# Altium schematic sheet 03 PMIC1.SchDoc
size 420 x 297 mm
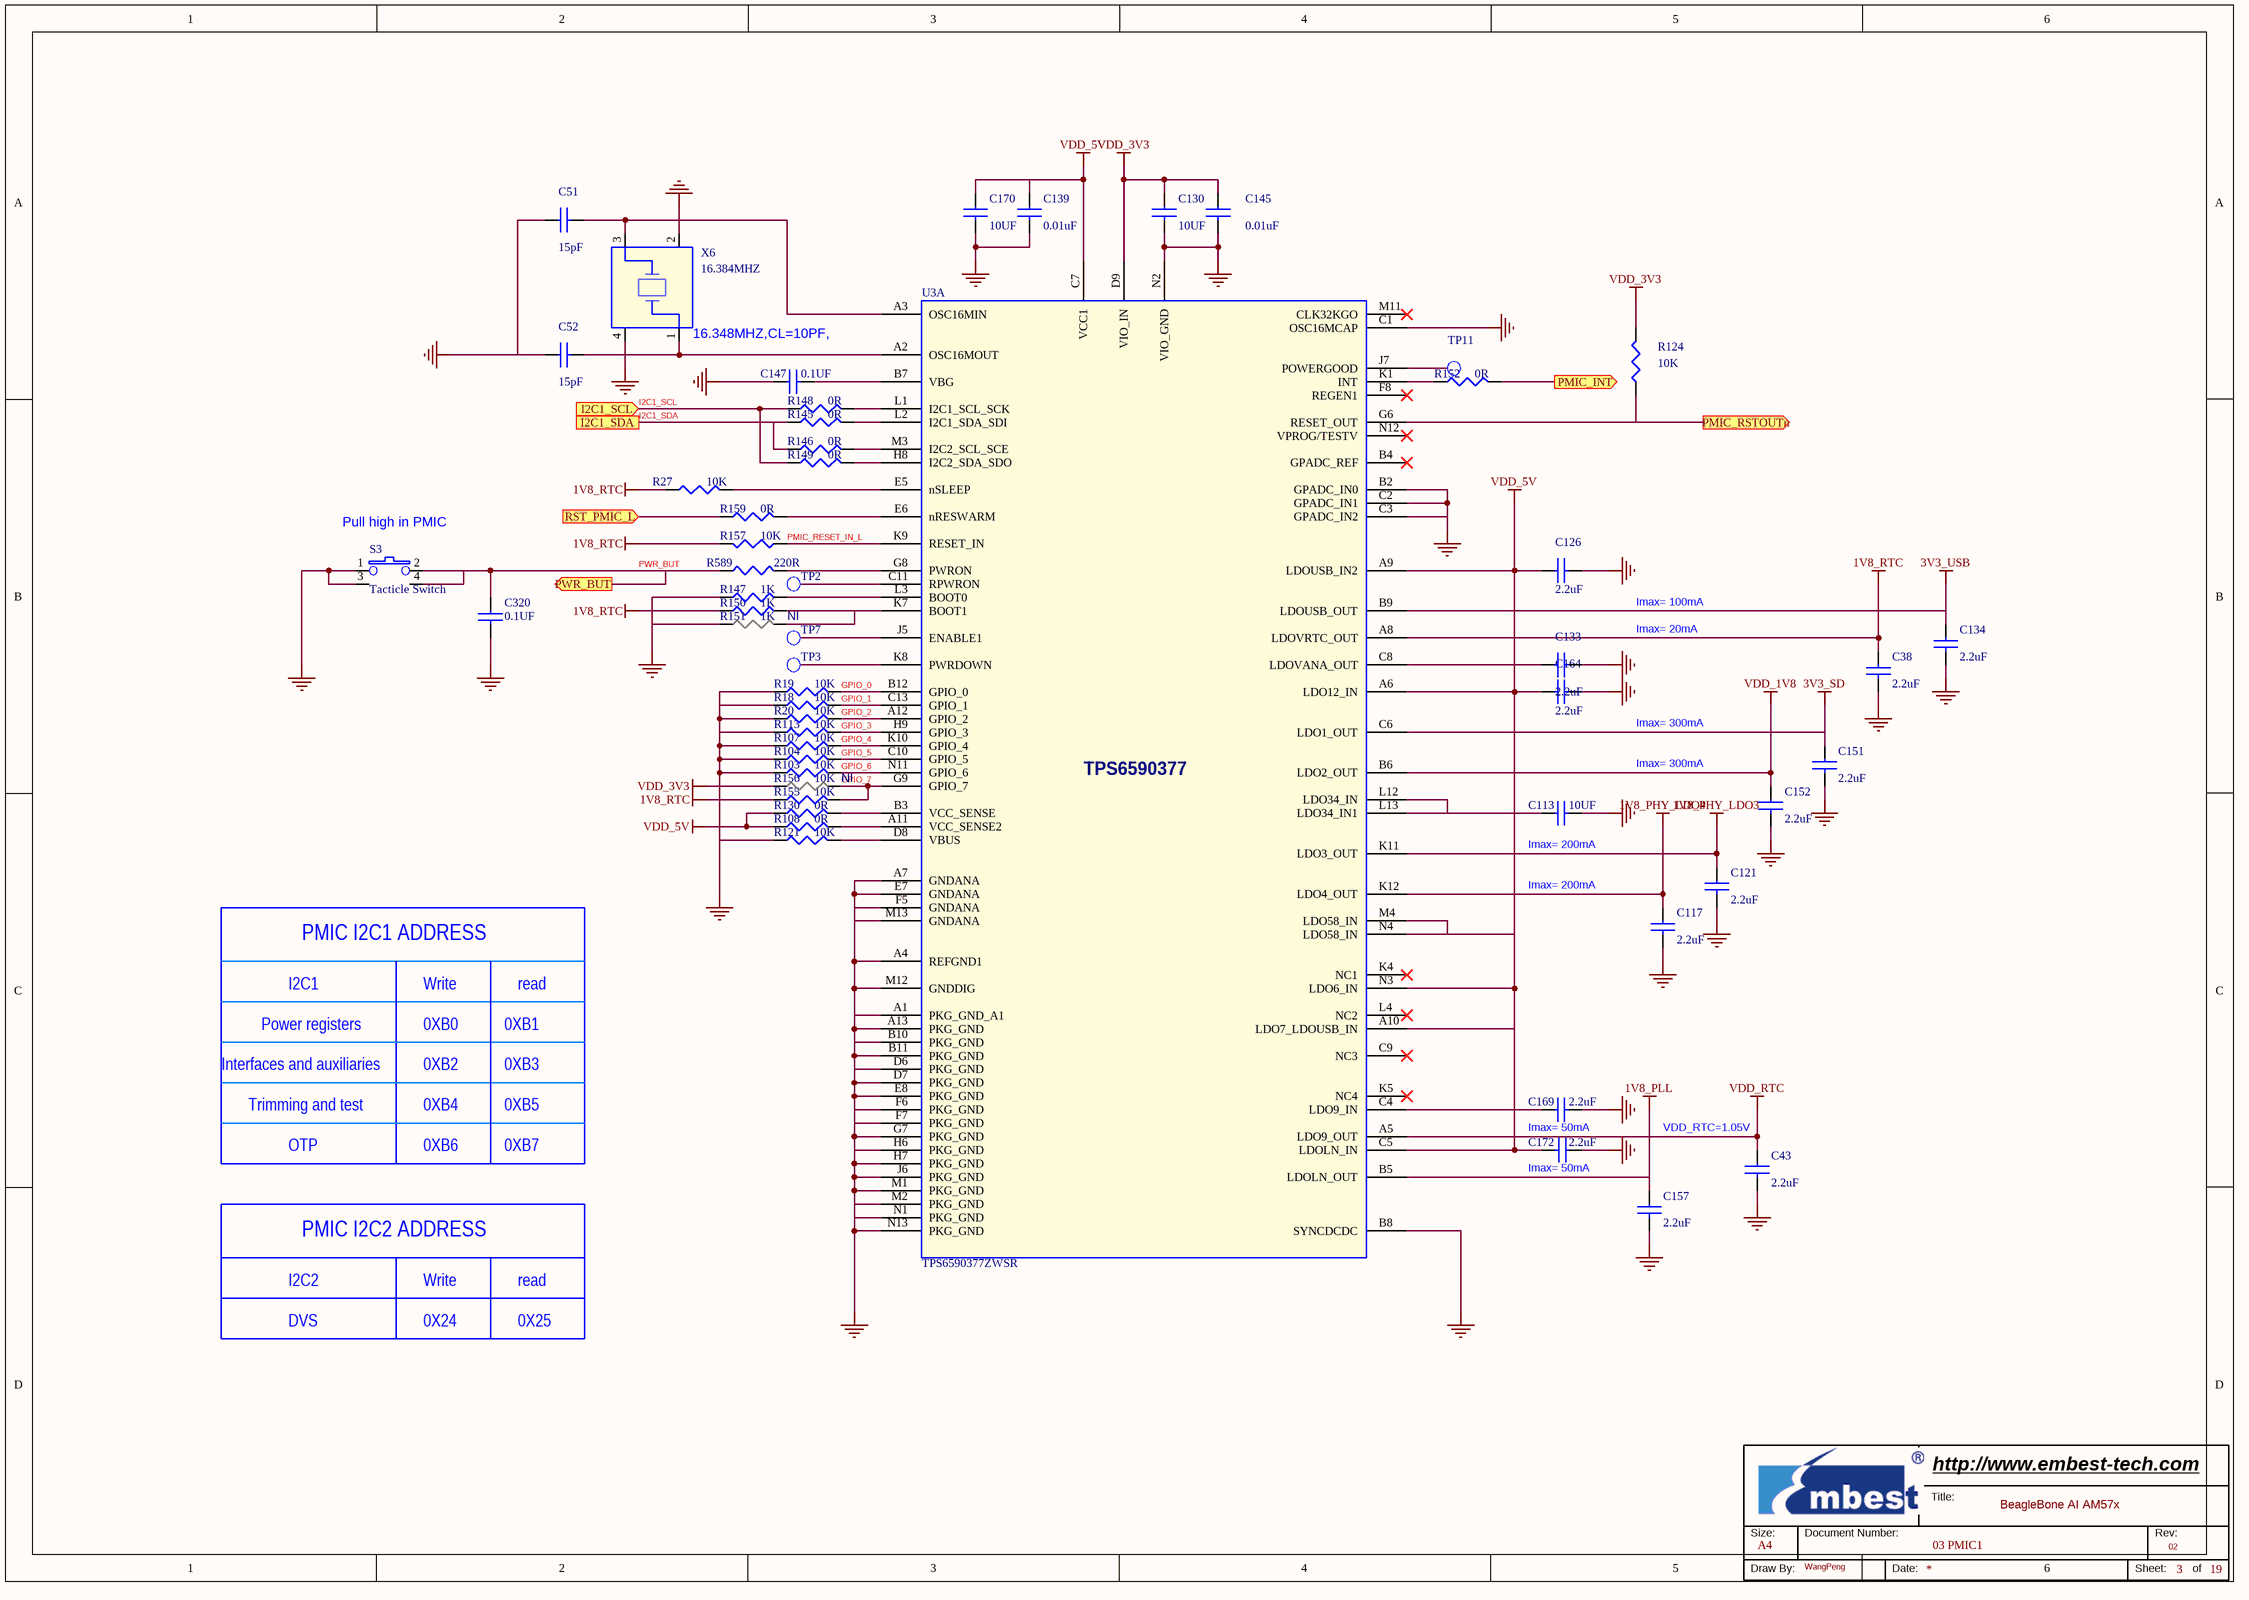
[diagram p0: 03 PMIC1.SchDoc]

## Parts
*  Page Count: 19  Page Number: 3  Page Size: A4  Title: BeagleBone AI AM57x  RevCode: 02  Doc: 03 PMIC1  Drawing: WangPeng  (hidden comment: Embest Title)  (graphical)
C38  2.2uF  [C0402]
C43  2.2uF  [C0402]
C51  15pF  [C0402]
C52  15pF  [C0402]
C113  10UF  [C0603]
C117  2.2uF  [C0402]
C121  2.2uF  [C0402]
C126  2.2uF  [C0603]
C130  10UF  [C0603]
C133  2.2uF  [C0402]
C134  2.2uF  [C0402]
C139  0.01uF  [C0402]
C145  0.01uF  [C0402]
C147  0.1UF  [C0402]
C151  2.2uF  [C0402]
C152  2.2uF  [C0402]
C157  2.2uF  [C0402]
C164  2.2uF  [C0603]
C169  2.2uF  [C0603]
C170  10UF  [C0603]
C172  2.2uF  [C0603]
C320  0.1UF  [C0402]
R18  10K  [R0402]
R19  10K  [R0402]
R20  10K  [R0402]
R27  10K  [R0402]
R103  10K  [R0402]
R104  10K  [R0402]
R107  10K  [R0402]
R108  0R  [R0402]
R113  10K  [R0402]
R121  10K  [R0402]
R124  10K  [R0402]
R130  0R  [R0402]
R145  0R  [R0402]
R146  0R  [R0402]
R147  1K  [R0402]
R148  0R  [R0402]
R149  0R  [R0402]
R150  1K  [R0402]
R151  1K  ASSY: NI  [R0402]
R152  0R  [R0402]
R155  10K  [R0402]
R156  10K  ASSY: NI  [R0402]
R157  10K  [R0402]
R159  0R  [R0402]
R589  220R  [R0402]
S3  Tacticle Switch  [SWS4B46X28]
TP2  NI  [TP1-8040]  (value not drawn)
TP3  NI  [TP1-8040]  (value not drawn)
TP7  NI  [TP1-8040]  (value not drawn)
TP11  NI  [TP1-8040]  (value not drawn)
U3  TPS6590377ZWSR  [bga12x12-169-55m]  (part A of 2)
X6  16.384MHZ  [OSCCC250x200x60-4N]

## Ports
I2C1_SCL (in), I2C1_SDA, PMIC_INT (out), PMIC_RSTOUTn (out), PWR_BUT (out), RST_PMIC_L (in)

## Nets
1V8_PHY_LDO3: C121.1 U3.K11(LDO3_OUT)
1V8_PHY_LDO4: C117.1 U3.K12(LDO4_OUT)
1V8_PLL: C157.1 U3.B5(LDOLN_OUT)
1V8_RTC: C38.1 R27.1 R150.1 R155.1 R157.2 U3.A8(LDOVRTC_OUT)
3V3_SD: C151.1 U3.C6(LDO1_OUT)
3V3_USB: C134.1 U3.B9(LDOUSB_OUT)
GND: C38.2 C43.2 C51.1 C52.1 C113.2 C117.2 C121.2 C126.2 C130.2 C133.2 C134.2 C139.2 C145.2 C147.1 C151.2 C152.2 C157.2 C164.2 C169.2 C170.2 C172.1 C320.2 R18.1 R19.1 R20.1 R103.1 R104.1 R107.1 R113.1 R121.1 R147.1 R151.1 S3.1 S3.3 U3.A1(PKG_GND_A1) U3.A4(REFGND1) U3.A7(GNDANA) U3.A13(PKG_GND) U3.B2(GPADC_IN0) U3.B8(SYNCDCDC) U3.B10(PKG_GND) U3.B11(PKG_GND) U3.C1(OSC16MCAP) U3.C2(GPADC_IN1) U3.C3(GPADC_IN2) U3.D6(PKG_GND) U3.D7(PKG_GND) U3.E7(GNDANA) U3.E8(PKG_GND) U3.F5(GNDANA) U3.F6(PKG_GND) U3.F7(PKG_GND) U3.G7(PKG_GND) U3.H6(PKG_GND) U3.H7(PKG_GND) U3.J6(PKG_GND) U3.M1(PKG_GND) U3.M2(PKG_GND) U3.M12(GNDDIG) U3.M13(GNDANA) U3.N1(PKG_GND) U3.N2(VIO_GND) U3.N13(PKG_GND) X6.2 X6.4
VDD_1V8: C152.1 U3.B6(LDO2_OUT)
VDD_3V3: C130.1 C145.1 R124.2 R156.1 U3.D9(VIO_IN)
VDD_5V: C126.1 C139.1 C164.1 C170.1 C172.2 R108.1 R130.1 U3.A6(LDO12_IN) U3.A9(LDOUSB_IN2) U3.A10(LDO7_LDOUSB_IN) U3.C5(LDOLN_IN) U3.C7(VCC1) U3.M4(LDO58_IN) U3.N3(LDO6_IN) U3.N4(LDO58_IN)
VDD_RTC: C43.1 U3.A5(LDO9_OUT)
GPIO_0: R19.2 U3.B12(GPIO_0)
GPIO_1: R18.2 U3.C13(GPIO_1)
GPIO_2: R20.2 U3.A12(GPIO_2)
GPIO_3: R113.2 U3.H9(GPIO_3)
GPIO_4: R107.2 U3.K10(GPIO_4)
GPIO_5: R104.2 U3.C10(GPIO_5)
GPIO_6: R103.2 U3.N11(GPIO_6)
GPIO_7: R155.2 R156.2 U3.G9(GPIO_7)
I2C1_SCL: R148.1 R149.1 ; port I2C1_SCL
I2C1_SDA: R145.1 R146.1 ; port I2C1_SDA
PMIC_INT: R152.2 ; port PMIC_INT
PMIC_RESET_IN_L: R157.1 U3.K9(RESET_IN)
PMIC_RSTOUTn: R124.1 U3.G6(RESET_OUT) ; port PMIC_RSTOUTn
PWR_BUT: C320.1 R589.1 S3.2 S3.4 ; port PWR_BUT
RST_PMIC_L: R159.1 ; port RST_PMIC_L
NetC51_2: C51.2 U3.A3(OSC16MIN) X6.3
NetC52_2: C52.2 U3.A2(OSC16MOUT) X6.1
NetC113_1: C113.1 U3.L12(LDO34_IN) U3.L13(LDO34_IN1)
NetC133_1: C133.1 U3.C8(LDOVANA_OUT)
NetC147_2: C147.2 U3.B7(VBG)
NetC169_1: C169.1 U3.C4(LDO9_IN)
NetR27_2: R27.2 U3.E5(nSLEEP)
NetR108_2: R108.2 U3.A11(VCC_SENSE2)
NetR121_2: R121.2 U3.D8(VBUS)
NetR130_2: R130.2 U3.B3(VCC_SENSE)
NetR145_2: R145.2 U3.L2(I2C1_SDA_SDI)
NetR146_2: R146.2 U3.M3(I2C2_SCL_SCE)
NetR147_2: R147.2 U3.L3(BOOT0)
NetR148_2: R148.2 U3.L1(I2C1_SCL_SCK)
NetR149_2: R149.2 U3.H8(I2C2_SDA_SDO)
NetR150_2: R150.2 R151.2 U3.K7(BOOT1)
NetR152_1: R152.1 U3.K1(INT)
NetR159_2: R159.2 U3.E6(nRESWARM)
NetR589_2: R589.2 U3.G8(PWRON)
NetTP2_1: TP2.1(TP) U3.C11(RPWRON)
NetTP3_1: TP3.1(TP) U3.K8(PWRDOWN)
NetTP7_1: TP7.1(TP) U3.J5(ENABLE1)
NetTP11_1: TP11.1(TP) U3.J7(POWERGOOD)

Not connected (* = marked no-connect by the designer): U3 B4(GPADC_REF)* C9(NC3)* F8(REGEN1)* K4(NC1)* K5(NC4)* L4(NC2)* M11(CLK32KGO)* N12(VPROG/TESTV)*

## Notes on the sheet
- (near X6) 16.348MHZ,CL=10PF,
- (near S3) Pull high in PMIC
- Imax= 100mA
- Imax= 20mA
- Imax= 300mA
- (near C113) Imax= 200mA
- Imax= 200mA
- I2C1
- PMIC I2C1 ADDRESS
- Write
- read
- Interfaces and auxiliaries
- Power registers
- 0XB0
- 0XB2
- 0XB1
- 0XB3
- Trimming and test
- 0XB4
- 0XB5
- Imax= 50mA
- (near C43) VDD_RTC=1.05V
- OTP
- 0XB6
- 0XB7
- (near C172) Imax= 50mA
- PMIC I2C2 ADDRESS
- I2C2
- DVS
- 0X24
- 0X25
- (in symbol Embest Title) Title:; Size:; Document Number:; Rev:; Draw By:; Date:; Sheet:; of
- (in symbol TPS659037, part A) TPS6590377

## Library data of the parts
C38 C117 C121 C134 C151 = C: CAP,2.2UF,+/-20%,X5R,6.3V,SMD0402; Manufacturer: Murata; Manufacturer Part Number: GRM155R60J225ME15D; Embest PN: 1004001100059; Part Type: Ceramic Capacitor
C43 C133 C152 C157 = C: CAP,2.2UF,+/-20%,X5R,6.3V,SMD0402; Manufacturer Part Number: GRM155R60J225ME15D; Manufacturer: Murata; Embest PN: 1004001100059; Part Type: Ceramic Capacitor
C51 = C: CAP,15pF,+/-2%,C0G,50V,SMD0402; Manufacturer: Murata; Manufacturer Part Number: GRM1555C1H150GA01D; Embest PN: 1004001100319; Part Type: Ceramic Capacitor; Datasheet: Y:\ÐÂK3ÏµÍ³ÎïÁÏdatasheet\[1003_1004]capacitor-resistor µçÈÝ¡¢µç×è\1004001100319 GRM1555C1H150GA01DMurata.pdf
C52 = C: CAP,15pF,+/-2%,C0G,50V,SMD0402; Manufacturer Part Number: GRM1555C1H150GA01D; Manufacturer: Murata; Embest PN: 1004001100319; Datasheet: Y:\ÐÂK3ÏµÍ³ÎïÁÏdatasheet\[1003_1004]capacitor-resistor µçÈÝ¡¢µç×è\1004001100319 GRM1555C1H150GA01DMurata.pdf; Part Type: Ceramic Capacitor
C113 = C: CAP,10UF,+/-10%,X5R,10V,SMD0603; Manufacturer: Murata; Manufacturer Part Number: GRM188R61A106KE69D; Embest PN: 1004001100129; Part Type: Ceramic Capacitor; Datasheet: Y:\ÐÂK3ÏµÍ³ÎïÁÏdatasheet\[1003_1004]capacitor-resistor µçÈÝ¡¢µç×è\1004001100129T2 C1608X5R1A106M.pdf
C126 C164 = C: CAP,2.2UF,+/-10%,X5R,16V,SMD0603; Manufacturer Part Number: GRM188R61C225KE15D; Manufacturer: Murata; Embest PN: 1004001100124; Part Type: Ceramic Capacitor
C130 C170 = C: CAP,10UF,+/-10%,X5R,10V,SMD0603; Manufacturer Part Number: GRM188R61A106KE69D; Manufacturer: Murata; Embest PN: 1004001100129; Datasheet: Y:\ÐÂK3ÏµÍ³ÎïÁÏdatasheet\[1003_1004]capacitor-resistor µçÈÝ¡¢µç×è\1004001100129T2 C1608X5R1A106M.pdf; Part Type: Ceramic Capacitor
C139 C145 = C: CAP,10NF,+/-10%,X7R,16V,SMD0402; Manufacturer Part Number: GRM155R71C103KA01D; Manufacturer: MURATA; Embest PN: 1004001100039; Part Type: Ceramic Capacitor
C147 = C: CAP,100NF,+/-10%,X7R,16V,SMD0402; Manufacturer: Murata; Manufacturer Part Number: GRM155R71C104KA88D; Embest PN: 1004001100047; Part Type: Ceramic Capacitor; Datasheet: Y:\ÐÂK3ÏµÍ³ÎïÁÏdatasheet\[1003_1004]capacitor-resistor µçÈÝ¡¢µç×è\1004001100047-GRM155R71C104KA88D.pdf
C169 C172 = C: CAP,2.2UF,+/-10%,X5R,16V,SMD0603; Manufacturer: Murata; Manufacturer Part Number: GRM188R61C225KE15D; Embest PN: 1004001100124; Part Type: Ceramic Capacitor
C320 = C: CAP,100NF,+/-10%,X7R,16V,SMD0402; Manufacturer Part Number: GRM155R71C104KA88D; Manufacturer: Murata; Embest PN: 1004001100047; Datasheet: Y:\ÐÂK3ÏµÍ³ÎïÁÏdatasheet\[1003_1004]capacitor-resistor µçÈÝ¡¢µç×è\1004001100047-GRM155R71C104KA88D.pdf; Part Type: Ceramic Capacitor
R18 R19 R27 R103 R104 R107 R113 = R: RES,10K,+/-5%,1/16W,SMD0402; Manufacturer Part Number: RC0402JR-0710KL; Manufacturer: YAGEO; Embest PN: 1003001100072; Part Type: Thick film Resistor
R20 = R: RES,10K,+/-5%,1/16W,SMD0402; Manufacturer Part Number: RC0402JR-0710KL; Manufacturer: YAGEO; SIGNAL_MODEL: RES_22_1/16W_5%_0402_402_22_5%_22_5%; Embest PN: 1003001100072; Part Type: Thick film Resistor
R108 R130 R148 R152 = R: RES,0R,+/-5%,1/16W,SMD0402; Manufacturer: YAGEO; Manufacturer Part Number: RC0402JR-070RL; Embest PN: 1003001100001; Part Type: Thick film Resistor
R121 R124 R155-R157 = R: RES,10K,+/-5%,1/16W,SMD0402; Manufacturer: YAGEO; Manufacturer Part Number: RC0402JR-0710KL; Embest PN: 1003001100072; Part Type: Thick film Resistor
R145 R146 R149 R159 = R: RES,0R,+/-5%,1/16W,SMD0402; Manufacturer Part Number: RC0402JR-070RL; Manufacturer: YAGEO; Embest PN: 1003001100001; Part Type: Thick film Resistor
R147 R151 = R: RES,1K,+/-5%,1/16W,SMD0402; Manufacturer Part Number: RC0402JR-071KL; Manufacturer: YAGEO; Embest PN: 1003001100035; Part Type: Thick film Resistor
R150 = R: RES,1K,+/-5%,1/16W,SMD0402; Manufacturer: YAGEO; Manufacturer Part Number: RC0402JR-071KL; Embest PN: 1003001100035; Part Type: Thick film Resistor
R589 = R: RES,220R,+/-5%,1/16W,SMD0402; Manufacturer: YAGEO; Manufacturer Part Number: RC0402JR-07220RL; Embest PN: 1003001100025; Part Type: Thick film Resistor
S3 = PSW4: Switch,Tactile,300gf+/-50gf,black housing,black plunger,4.6*2.8*1.9MM,SMD; Manufacturer Part Number: KMR231GLFS; Manufacturer: C&K; Embest PN: 1010001100030; Datasheet: Y:\ÐÂK3ÏµÍ³ÎïÁÏdatasheet\[1010]switches ¿ª¹Ø°´¼ü\1010001100030_KMR231GLFS_C&K.pdf; Part Type: TACT
TP2 TP3 TP7 TP11 = TEST POINT: Test point,DIA 30mil; PCB Footprint: TP30; Embest PN: PN008; Part Type: TP
U3 = TPS659037: IC TPS659037 Power Management Unit (PMU) for Processor NFBGA-169 SMD; Manufacturer: TI; Embest PN: 1002004100230; Part Type: Power Management; Manufacturer Part Number: TPS6590377ZWSR; Status: AM5728; Datasheet: Y:\ÐÂK3ÏµÍ³ÎïÁÏdatasheet\[1002]IC ¼¯³ÉµçÂ·\1002004100230 [TPS6590377ZWSR] tps659037.pdf
X6 = X4: Crystal,5ZAA16384102TFA5Q3,16.384MHz,+/-20PPM,10PF,2520-4 pads,SMD; Manufacturer: INTERQUIP; Embest PN: 1008002100252; Rating: 20PPM; Part Type: Crystal; Manufacturer Part Number: 5ZAA16384102TFA5Q3; Status: Hamster AM572x; Datasheet: Y:\ÐÂK3ÏµÍ³ÎïÁÏdatasheet\[1008]crystal ¾§Ìå\1008002100252 5ZAA16384102TFA5Q3¹æ¸ñÊé.pdf
* = Embest Title: Page Create Date: May 29, 2006; WebSite: http://www.embest-tech.com; Company: Embest; Page Modify Date: *